# EAGLE design MotorControllerMainBoard (EAGLE 8.7.1)

## Sheet 1 of 6: Main Board Topology
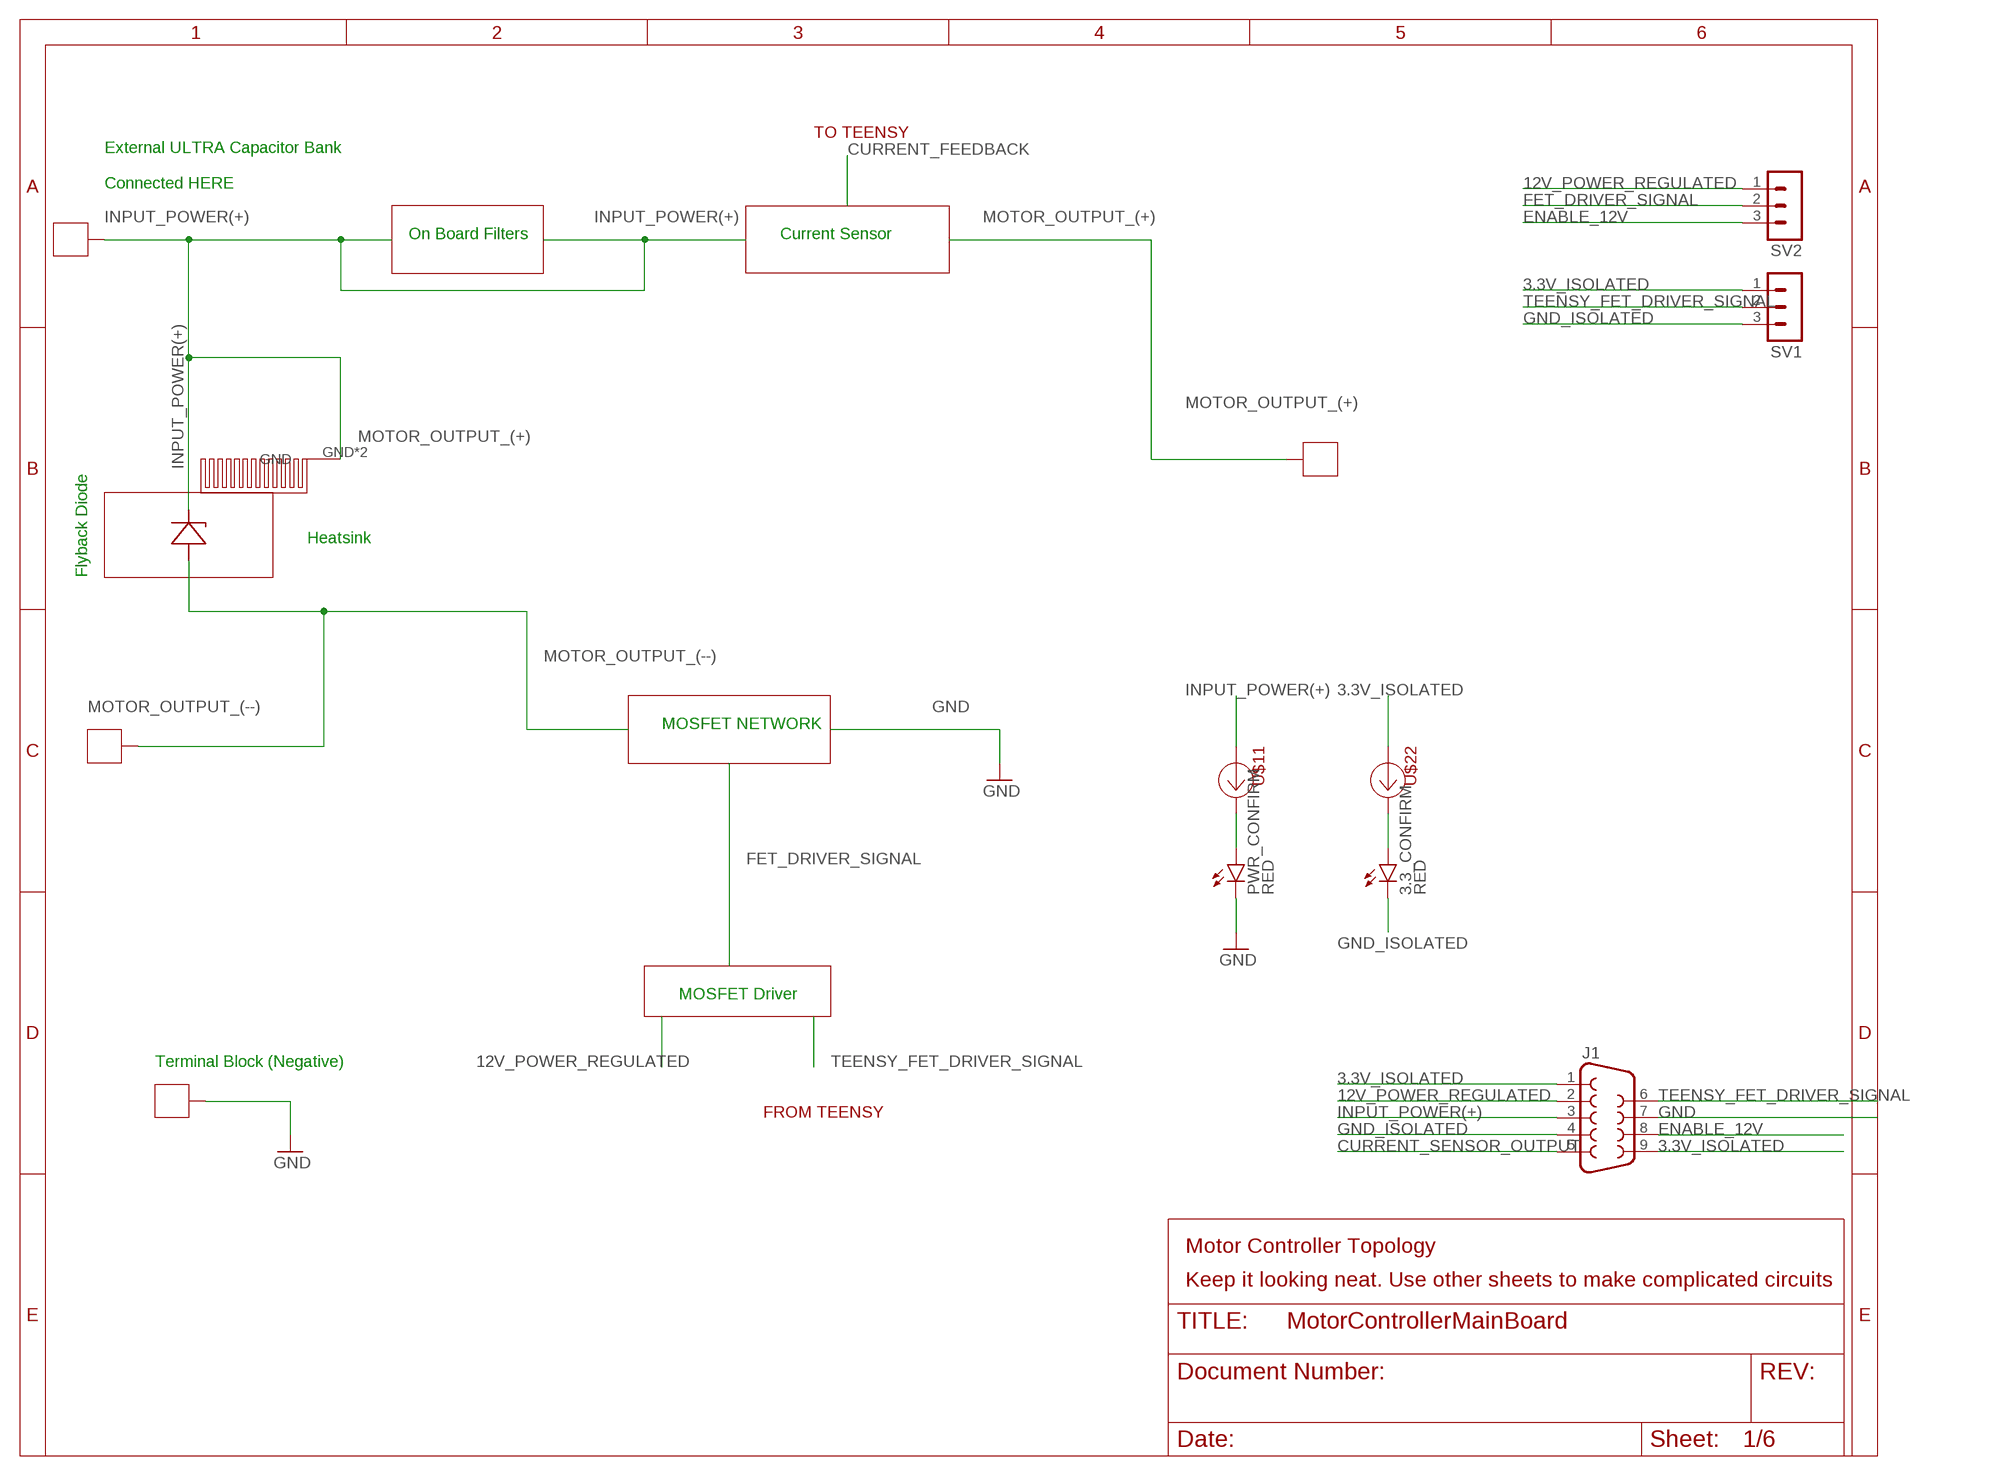
[diagram p0: schematic, sheet 1]

### Parts
3.3_CONFIRM  RED  LED-RED1206  [LED-1206]
J1  DB9FEMALE  [DB9]
PWR_CONFIRM  RED  LED-RED1206  [LED-1206]
SV1  MA03-1  [MA03-1]
SV2  MA03-1  [MA03-1]
U$5  FLYBACK  [TO]
U$11  AL5809-20S1-7  [SOD-123]
U$12  74650073R  [74650073R]
U$14  74650073R  [74650073R]
U$15  74650073R  [74650073R]
U$16  74650073R  [74650073R]
U$22  AL5809-20S1-7  [SOD-123]
U$23  DA-T263-101E  [DA-T263-101E]

### Nets
3.3V_ISOLATED: J1.1 J1.9 SV1.1 U$22.A ; also sheet 4
12V_POWER_REGULATED: J1.2 SV2.1 ; also sheet 3,5
CURRENT_SENSOR_OUTPUT: J1.5 ; also sheet 4
ENABLE_12V: J1.8 SV2.3 ; also sheet 5
FET_DRIVER_SIGNAL: SV2.2 ; also sheet 2,3
GND: J1.7 PWR_CONFIRM.C U$15.P$1 U$15.P$2 U$15.P$3 U$15.P$4 ; also sheet 2,3,5,6
GND_ISOLATED: 3.3_CONFIRM.C J1.4 SV1.3 ; also sheet 3,4
INPUT_POWER(+): J1.3 U$5.CATHODE U$11.A U$14.P$1 U$14.P$2 U$14.P$3 U$14.P$4 U$23.GND U$23.GND2\(GND) ; also sheet 4,5
MOTOR_OUTPUT_(+): U$16.P$1 U$16.P$2 U$16.P$3 U$16.P$4 ; also sheet 4,6
MOTOR_OUTPUT_(--): U$5.ANODE U$12.P$1 U$12.P$2 U$12.P$3 U$12.P$4 ; also sheet 2
N$14: 3.3_CONFIRM.A U$22.C
N$17: PWR_CONFIRM.A U$11.C
TEENSY_FET_DRIVER_SIGNAL: J1.6 SV1.2 ; also sheet 3

### Notes on the sheet
- TO TEENSY
- External ULTRA Capacitor Bank 
  
  Connected HERE
- On Board Filters | Current Sensor
- Heatsink
- Flyback Diode
- MOSFET NETWORK
- MOSFET Driver
- Terminal Block (Negative)
- FROM TEENSY
- Motor Controller Topology
- Keep it looking neat. Use other sheets to make complicated circuits

## Sheet 2 of 6: MOSFET NETWORK
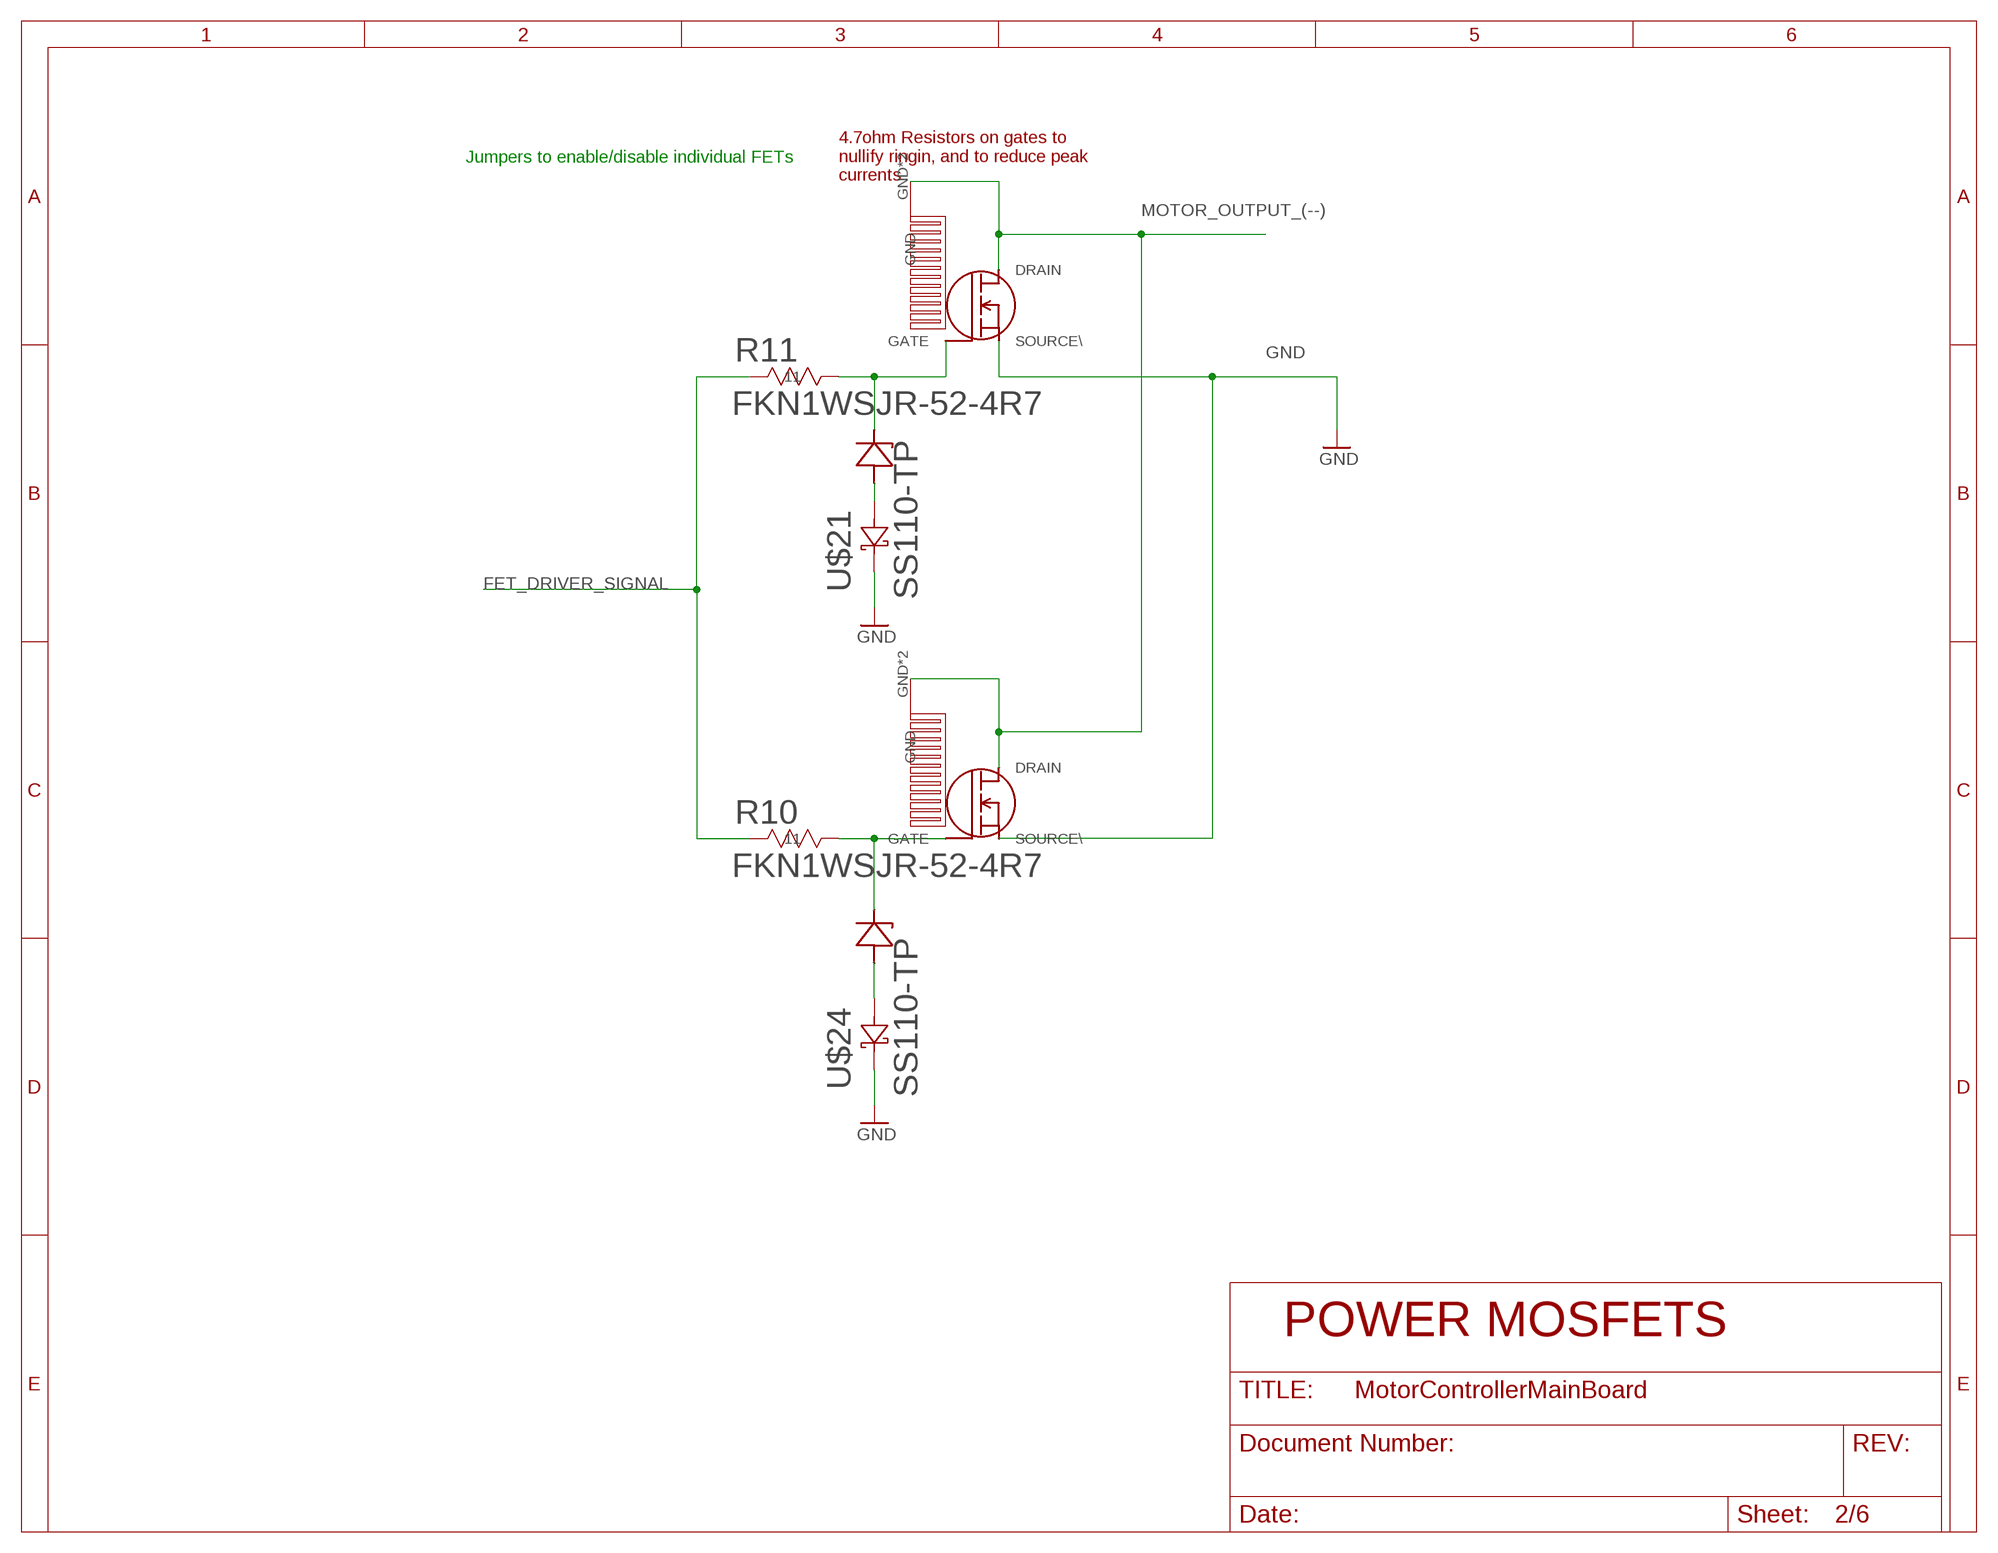
[diagram p1: schematic, sheet 2]

### Parts
R10  FKN1WSJR-52-4R7  [YAG_FKN50]
R11  FKN1WSJR-52-4R7  [YAG_FKN50]
U$1  IPB015N08N5ATMA1  [IPB015N08N5ATMA1]
U$2  IPB015N08N5ATMA1  [IPB015N08N5ATMA1]
U$3  DA-T263-101E  [DA-T263-101E]
U$4  DA-T263-101E  [DA-T263-101E]
U$7  SMBJ15CD  [SMB-DIODE]
U$20  SMBJ15CD  [SMB-DIODE]
U$21  SS110-TP  [SMA-DIODE]
U$24  SS110-TP  [SMA-DIODE]

### Nets
FET_DRIVER_SIGNAL: R10.1 R11.1 ; also sheet 1,3
GND: U$1.SOURCE(SOURCE\) U$2.SOURCE(SOURCE\) U$21.C(CATHODE) U$24.C(CATHODE) ; also sheet 1,3,5,6
MOTOR_OUTPUT_(--): U$1.DRAIN U$2.DRAIN U$3.GND U$3.GND2\(GND) U$4.GND U$4.GND2\(GND) ; also sheet 1
N$1: U$7.A(ANODE) U$24.A(ANODE)
N$2: R10.2 U$2.GATE U$7.C(CATHODE)
N$4: U$20.A(ANODE) U$21.A(ANODE)
N$10: R11.2 U$1.GATE U$20.C(CATHODE)

### Notes on the sheet
- Jumpers to enable/disable individual FETs
- 4.7ohm Resistors on gates to
  nullify ringin, and to reduce peak
  currents
- POWER MOSFETS

## Sheet 3 of 6: MOSFET Driver
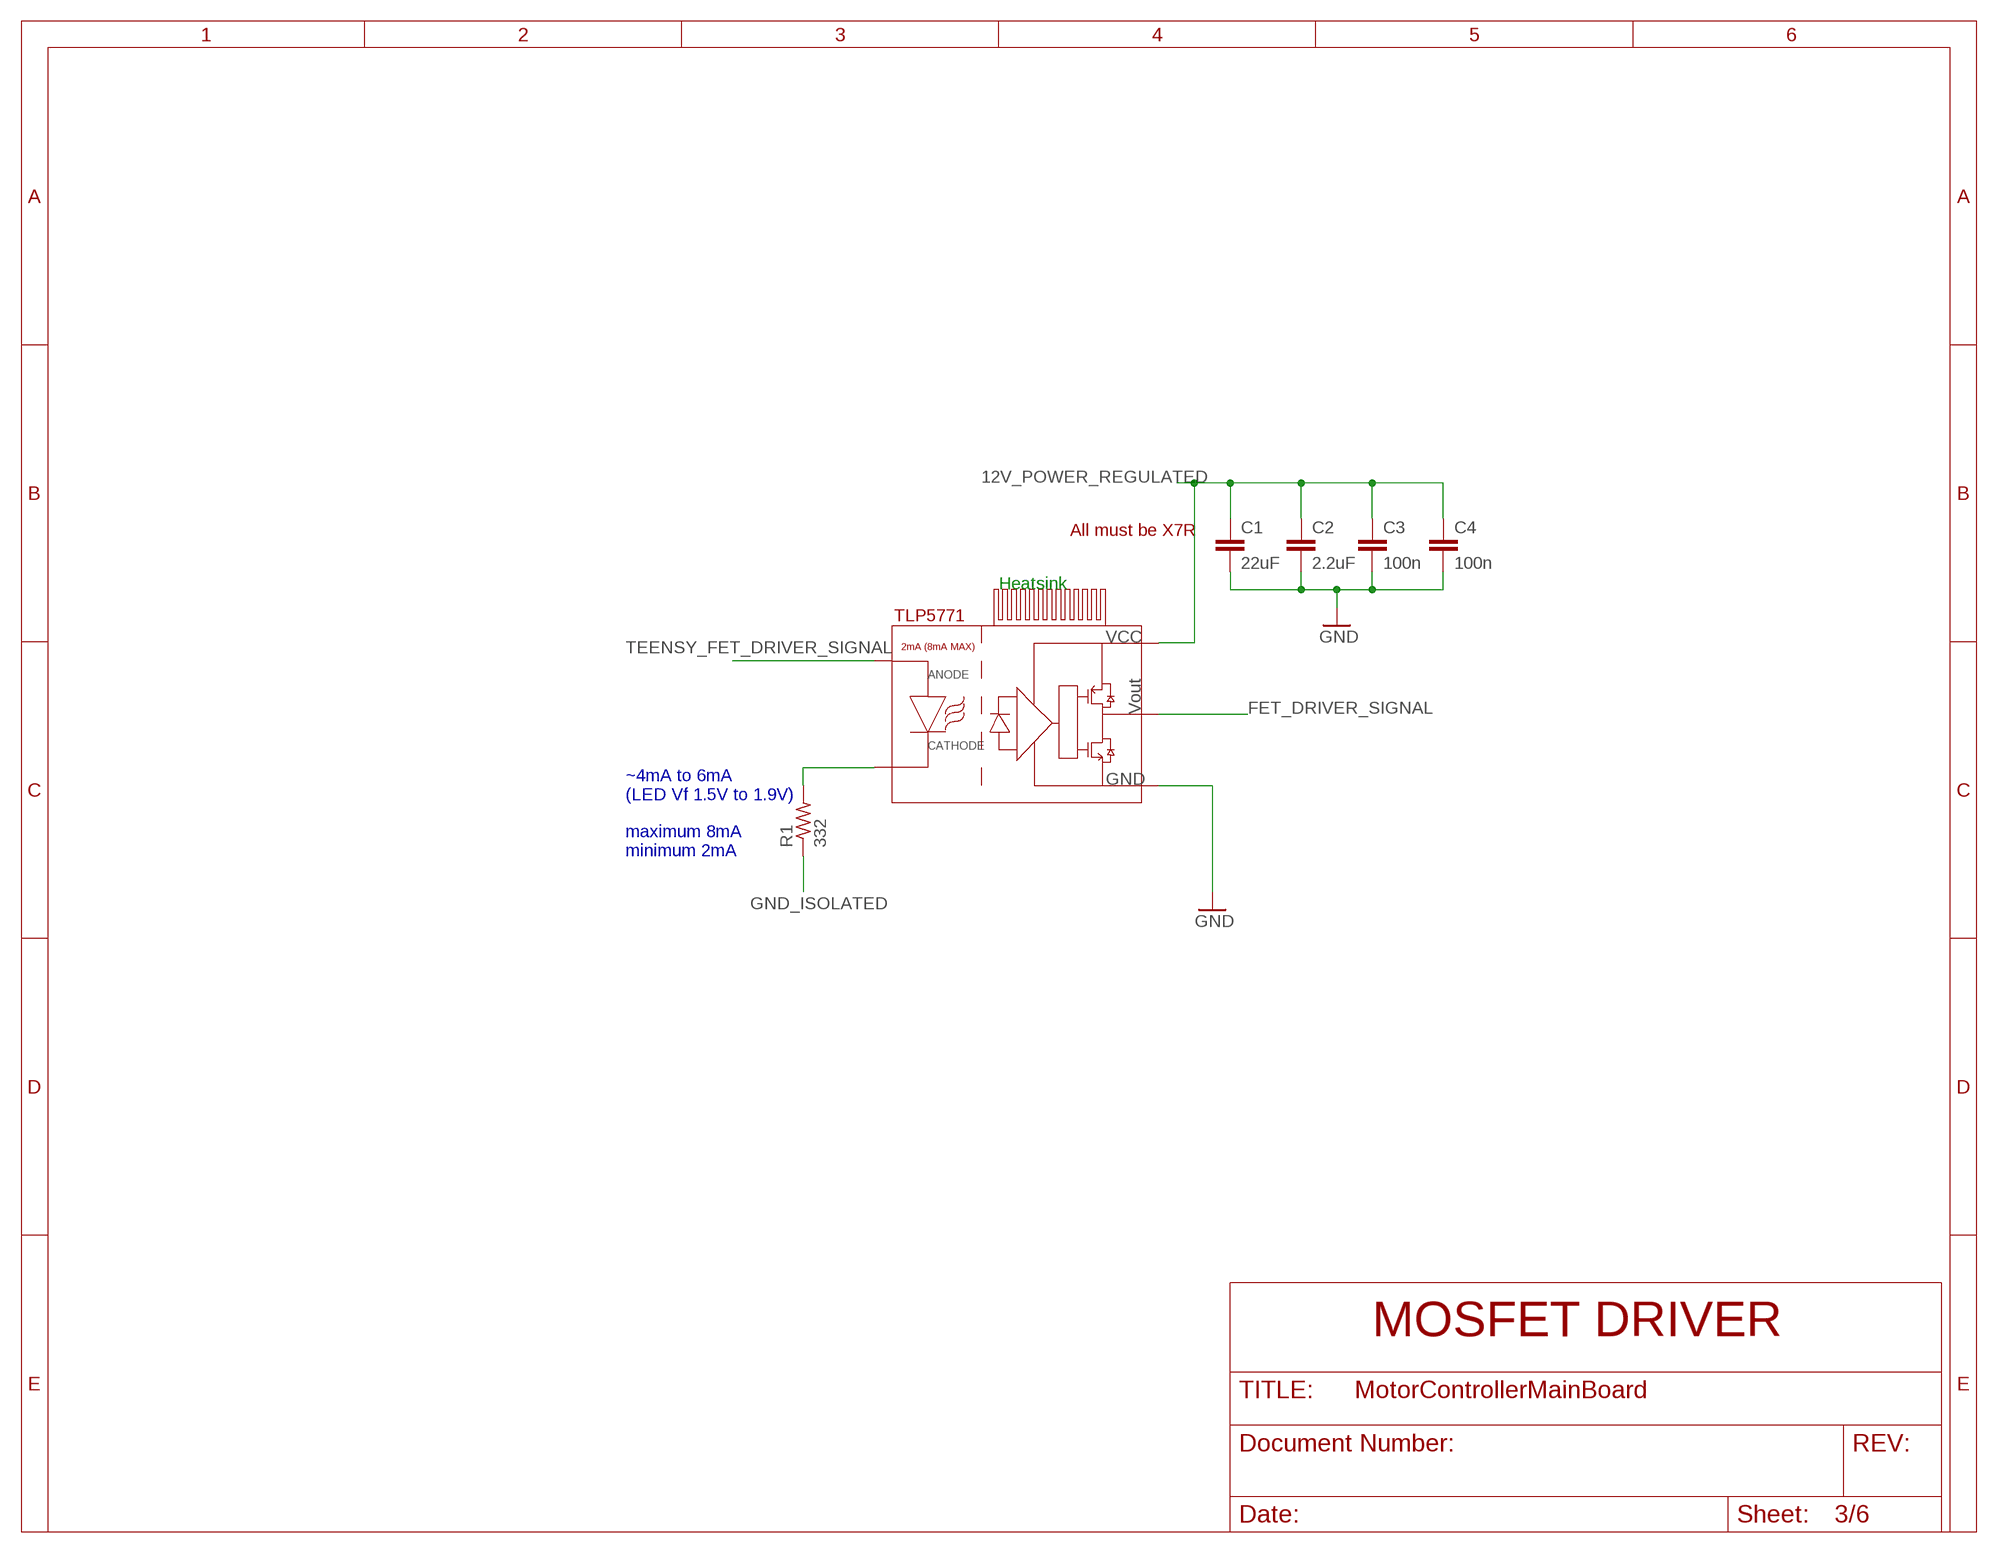
[diagram p2: schematic, sheet 3]

### Parts
C1  22uF  C-EUC1210  [C1210]
C2  2.2uF  C-EUC0805  [C0805]
C3  100n  C-EUC0603  [C0603]
C4  100n  C-EUC0603  [C0603]
R1  332  R-US_R0805  [R0805]
U$17  TLP5771  [SOIC-6(TLP5771)]
U$25  LTN20069  [LTN20069]

### Nets
12V_POWER_REGULATED: C1.1 C2.1 C3.1 C4.1 U$17.6.VCC ; also sheet 1,5
FET_DRIVER_SIGNAL: U$17.5.VOUT ; also sheet 1,2
GND: C1.2 C2.2 C3.2 C4.2 U$17.4.GND ; also sheet 1,2,5,6
GND_ISOLATED: R1.1 ; also sheet 1,4
N$7: R1.2 U$17.2.NC(3.CATHODE) U$17.3:CATHODE(3.CATHODE)
TEENSY_FET_DRIVER_SIGNAL: U$17.1.ANODE ; also sheet 1

### Notes on the sheet
- All must be X7R
- Heatsink
- ~4mA to 6mA 
  (LED Vf 1.5V to 1.9V)
  
  maximum 8mA
  minimum 2mA
- MOSFET DRIVER

## Sheet 4 of 6: Current Sensor
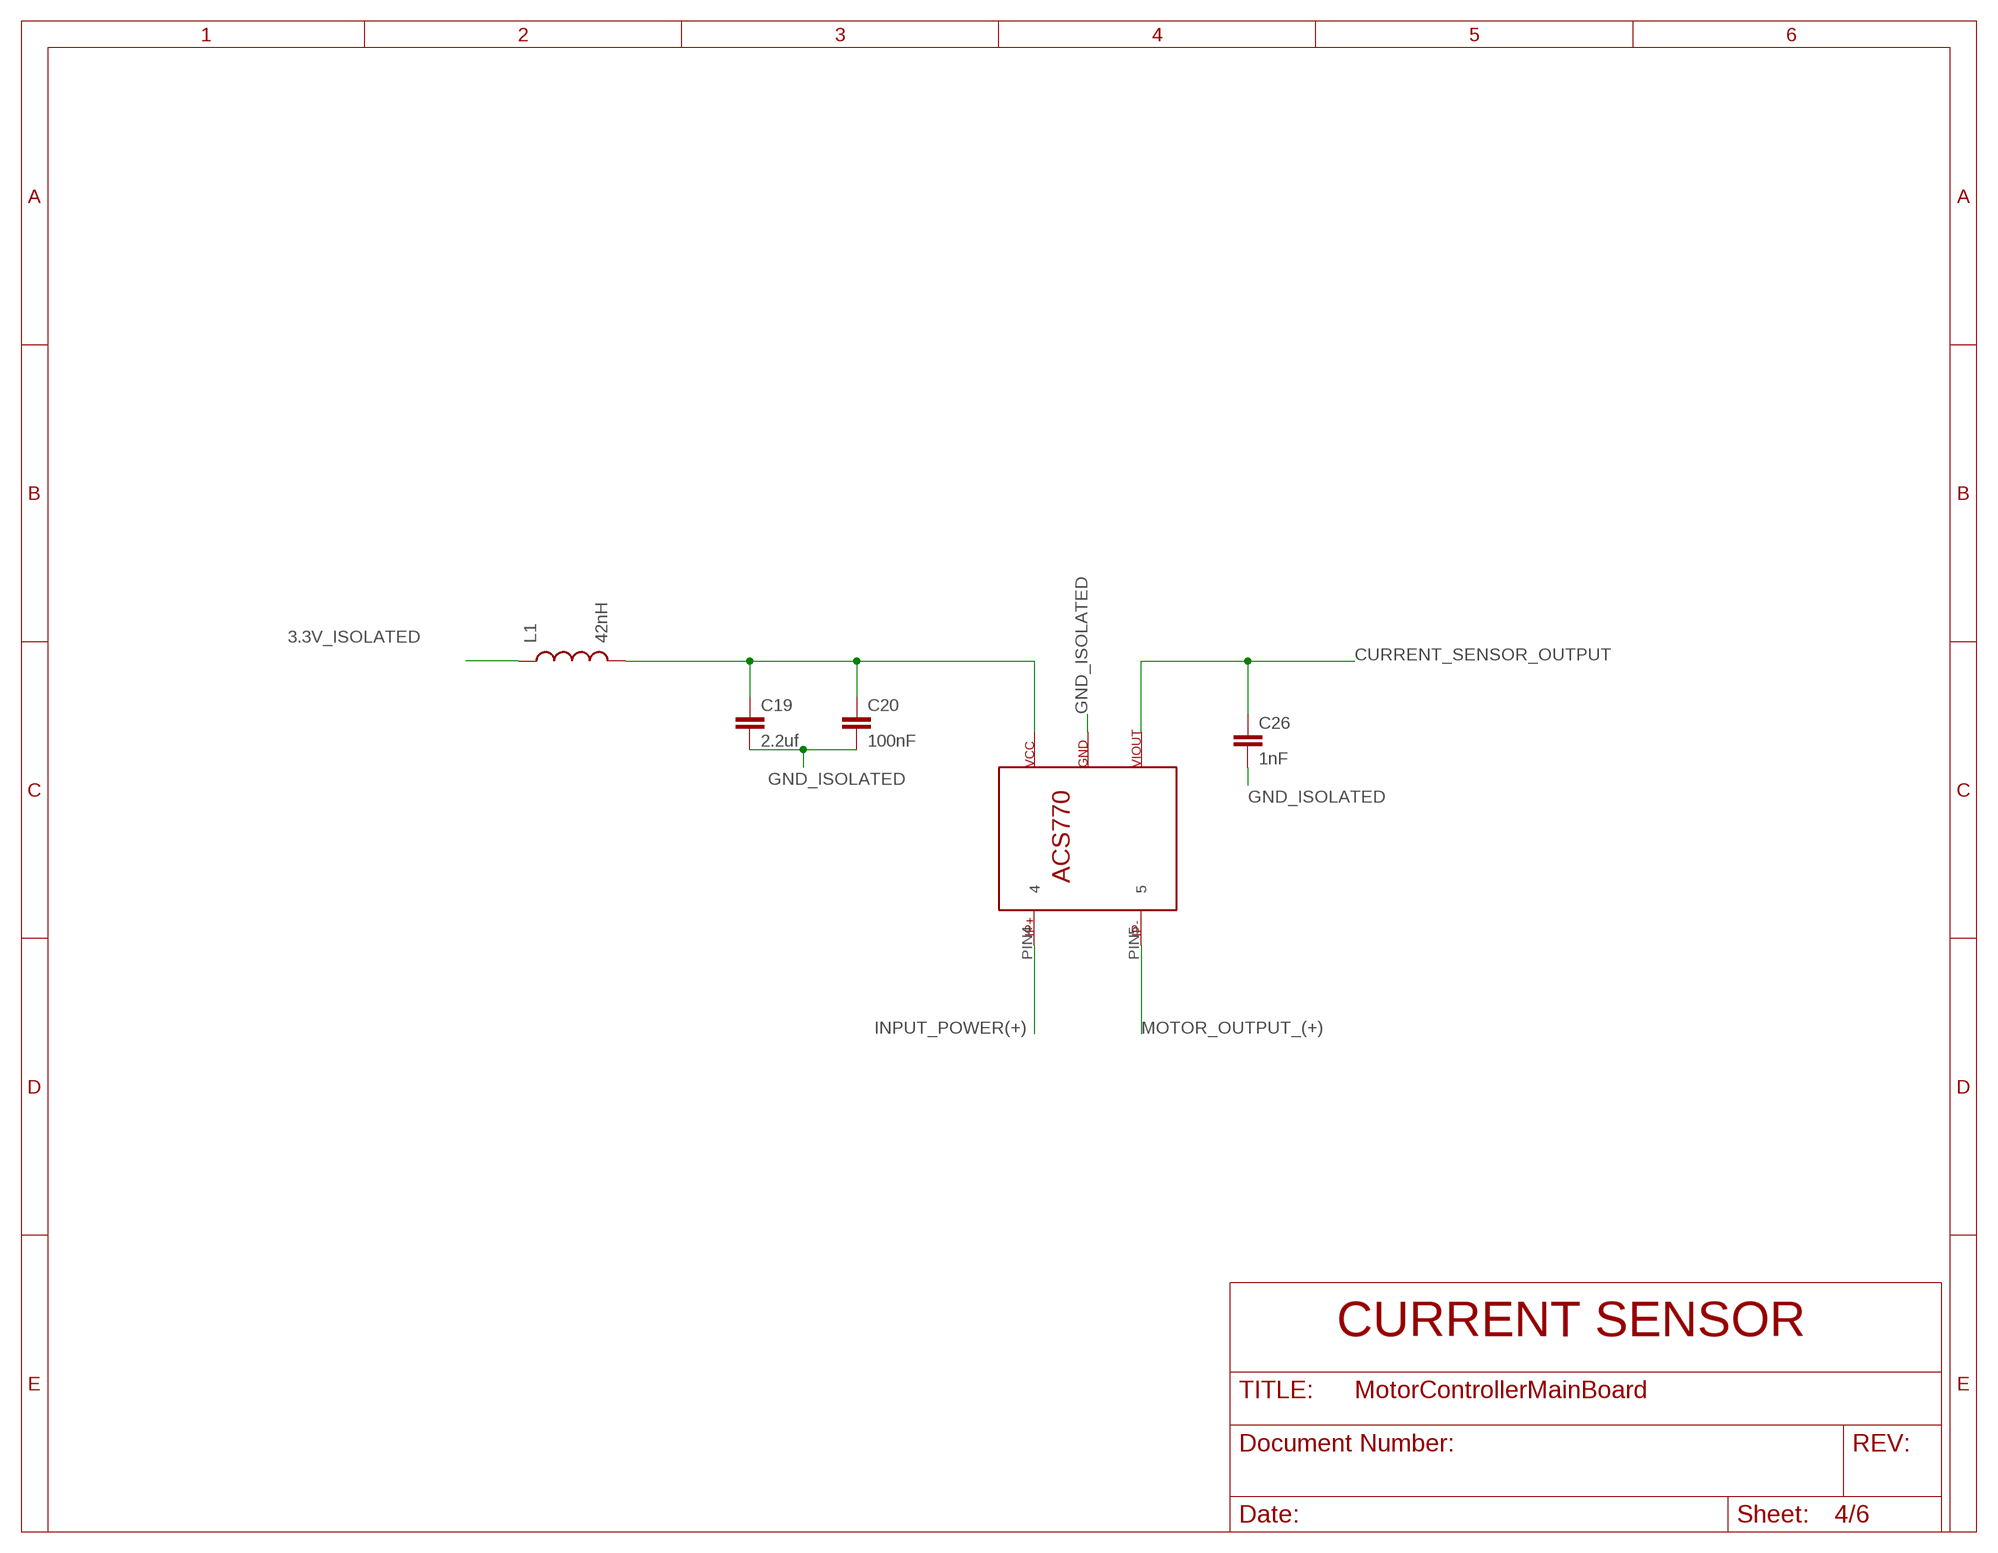
[diagram p3: schematic, sheet 4]

### Parts
C19  2.2uf  C-EUC0805  [C0805]
C20  100nF  C-EUC0805  [C0805]
C26  1nF  C-EUC0805  [C0805]
L1  42nH  INDUCTOR0805  [0805]
U$9  ACS770LCB_CURRENTSENSOR  [ACS770LCB_CURRENTSENSOR]

### Nets
3.3V_ISOLATED: L1.1 ; also sheet 1
CURRENT_SENSOR_OUTPUT: C26.1 U$9.PIN3 ; also sheet 1
GND_ISOLATED: C19.2 C20.2 C26.2 U$9.PIN2 ; also sheet 1,3
INPUT_POWER(+): U$9.PIN4 ; also sheet 1,5
MOTOR_OUTPUT_(+): U$9.PIN5 ; also sheet 1,6
N$6: C19.1 C20.1 L1.2 U$9.PIN1

### Notes on the sheet
- CURRENT SENSOR

## Sheet 5 of 6: Power Supply
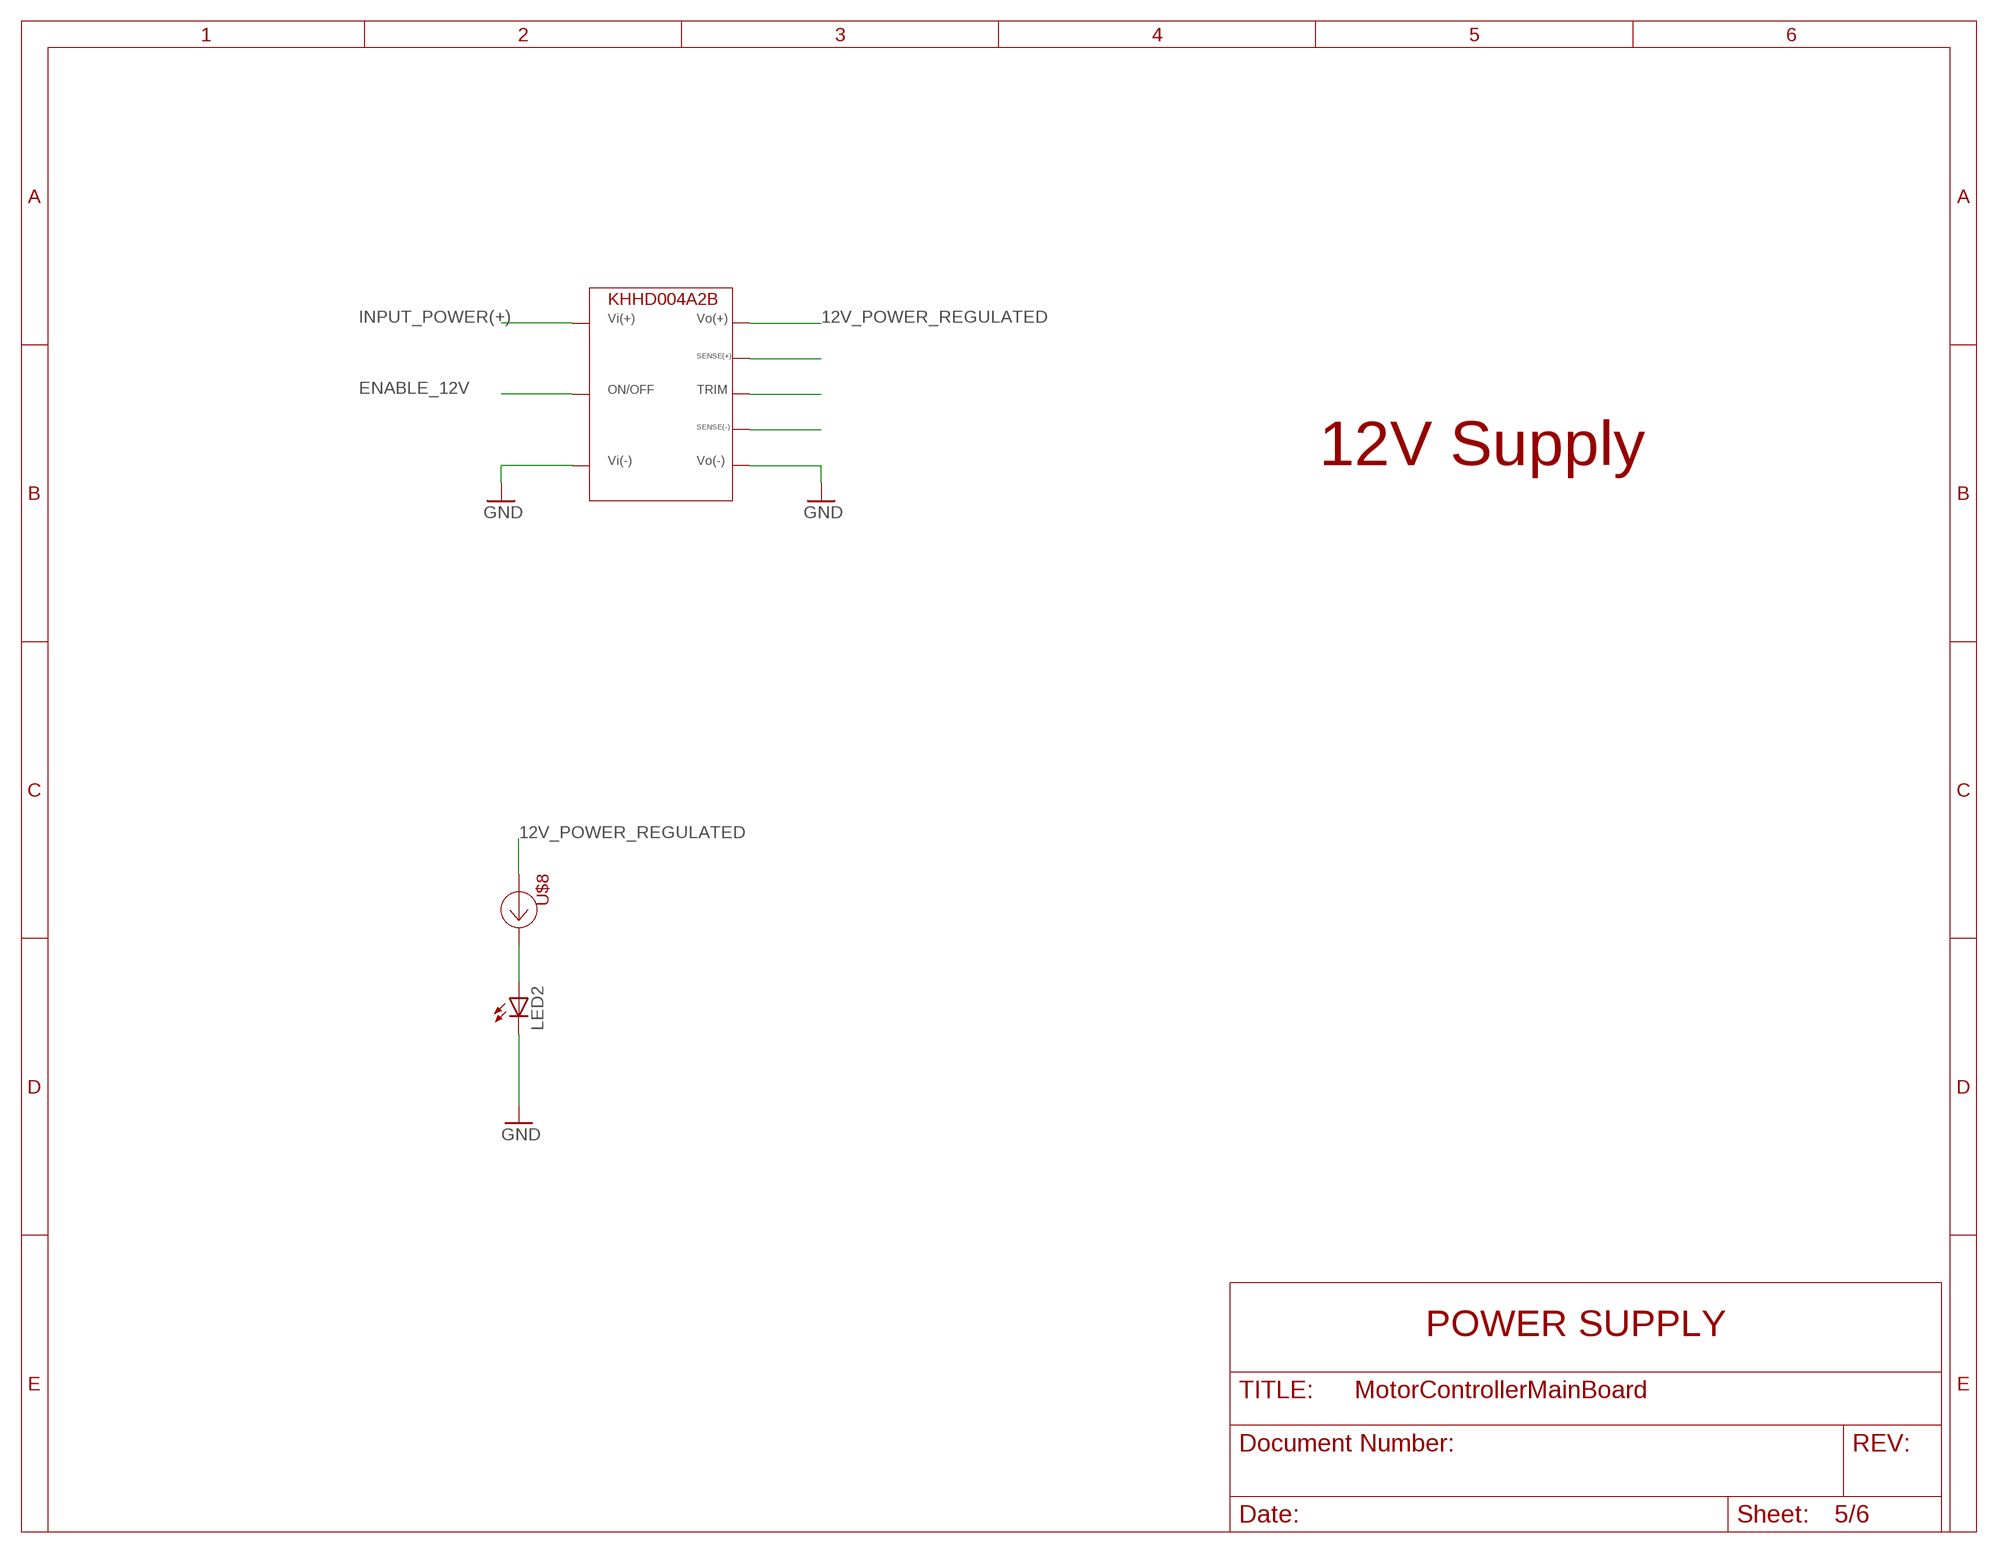
[diagram p4: schematic, sheet 5]

### Parts
LED2  LED1206  [LED-1206]
U$6  KHHD004A2B  [KHHD004A2B]
U$8  AL5809-20S1-7  [SOD-123]

### Nets
12V_POWER_REGULATED: U$6.VO+(VO(+)) U$8.A ; also sheet 1,3
ENABLE_12V: U$6.ON/OFF ; also sheet 1
GND: LED2.C U$6.VI-(VI(-)) U$6.VO-(VO(-)) ; also sheet 1,2,3,6
INPUT_POWER(+): U$6.VI+(VI(+)) ; also sheet 1,4
N$5: U$6.SENSE-(SENSE(-))
N$8: U$6.TRIM
N$9: LED2.A U$8.C
N$11: U$6.SENSE+(SENSE(+))

### Notes on the sheet
- 12V Supply
- POWER SUPPLY

## Sheet 6 of 6: Input Filters
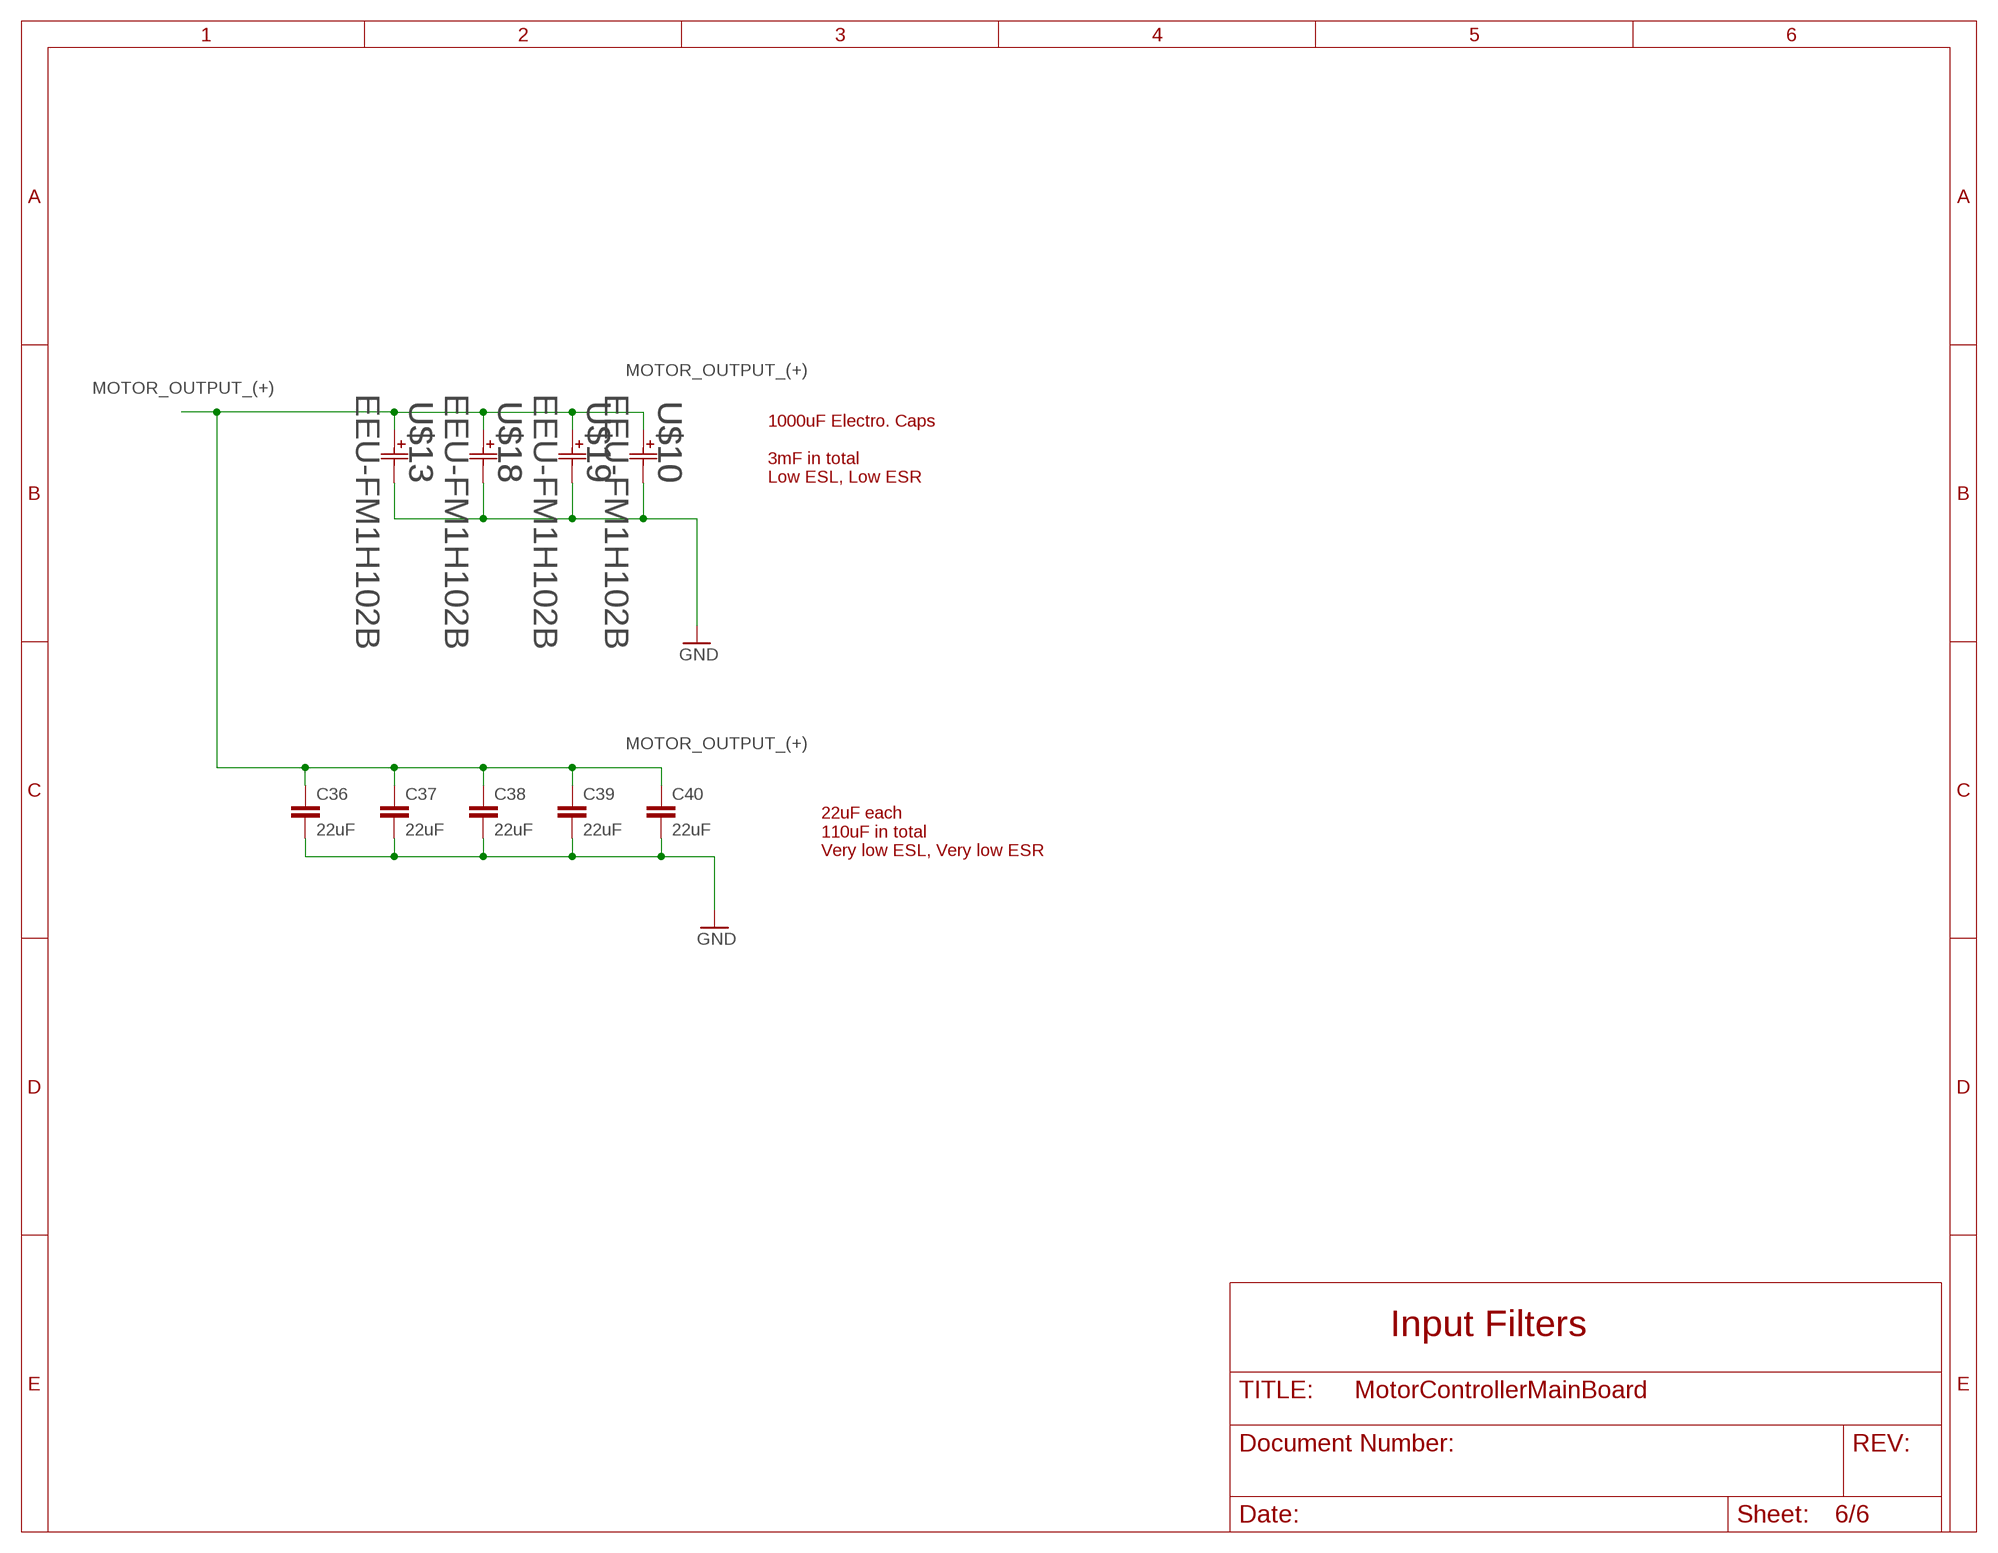
[diagram p5: schematic, sheet 6]

### Parts
C36  22uF  C-EUC1210  [C1210]
C37  22uF  C-EUC1210  [C1210]
C38  22uF  C-EUC1210  [C1210]
C39  22uF  C-EUC1210  [C1210]
C40  22uF  C-EUC1210  [C1210]
U$10  EEU-FM1H102B  [EEU-FM1H102B]
U$13  EEU-FM1H102B  [EEU-FM1H102B]
U$18  EEU-FM1H102B  [EEU-FM1H102B]
U$19  EEU-FM1H102B  [EEU-FM1H102B]

### Nets
GND: C36.2 C37.2 C38.2 C39.2 C40.2 U$10.NEGATIVE U$13.NEGATIVE U$18.NEGATIVE U$19.NEGATIVE ; also sheet 1,2,3,5
MOTOR_OUTPUT_(+): C36.1 C37.1 C38.1 C39.1 C40.1 U$10.POSITIVE U$13.POSITIVE U$18.POSITIVE U$19.POSITIVE ; also sheet 1,4

### Notes on the sheet
- 1000uF Electro. Caps
  
  3mF in total
  Low ESL, Low ESR
- 22uF each
  110uF in total
  Very low ESL, Very low ESR
- Input Filters

## Library data of the parts
3.3_CONFIRM PWR_CONFIRM = SparkFun-LED:LED-RED: Assorted Red LEDs LilyPad 1206- DIO-09912 1206- DIO-00809 0603- DIO-00819 "SMART" means more efficient and expensive; PROD_ID: DIO-09912
C1-C4 C36-C40 = rcl:C-EU: CAPACITOR, European symbol; SPICEPREFIX: C
C19 C20 C26 = resistor:C-EU: CAPACITOR, European symbol
J1 = SparkFun-Connectors:DB9: DB9 Connector Standard DB9 (D-Sub 9) serial connector. Can be used for CAN bus as well as RS485 and RS232. Footprint production proven. Spark Fun Electronics SKU : PRT-00429; PROD_ID: CONN-08194
L1 = SparkFun (2015_10_14 22_27_04 UTC):INDUCTOR: Inductors Basic Inductor/Choke - 0603 and 1206. Footprints are not proven and vary greatly between part numbers.
LED2 = SparkFun (2015_10_14 22_27_04 UTC):LED: LEDs Standard schematic elements and footprints for 5mm, 3mm, 1206, and 0603 sized LEDs. 5mm - Spark Fun Electronics SKU : COM-00529 (and others)
R1 = resistor:R-US_: RESISTOR, American symbol
R10 R11 = MotorControllerEagleLibrary:FKN1WSJR-52-4R7; MANUFACTURER_PART_NUMBER: FKN1WSJR524R7; VENDOR: Yageo
SV1 SV2 = con-lstb:MA03-1: PIN HEADER; OC_FARNELL: unknown; OC_NEWARK: unknown
U$1 U$2 = MotorControllerEagleLibrary:IPB015N08N5ATMA1
U$3 U$4 U$23 = MotorControllerEagleLibrary:DA-T263-101E
U$5 = MotorControllerEagleLibrary:FLYBACK
U$6 = MotorControllerEagleLibrary:KHHD004A2B
U$7 U$20 = MotorControllerEagleLibrary:SMBJ15CD
U$8 U$11 U$22 = MotorControllerEagleLibrary:AL5809-20S1-7
U$9 = ACS770 Current Sensor:ACS770LCB_CURRENTSENSOR
U$10 U$13 U$18 U$19 = MotorControllerEagleLibrary:EEU-FM1H102B
U$12 U$14-U$16 = MotorControllerEagleLibrary:74650073R
U$17 = MotorControllerEagleLibrary:TLP5771
U$21 U$24 = MotorControllerEagleLibrary:SS110-TP
U$25 = MotorControllerEagleLibrary:LTN20069

## Board
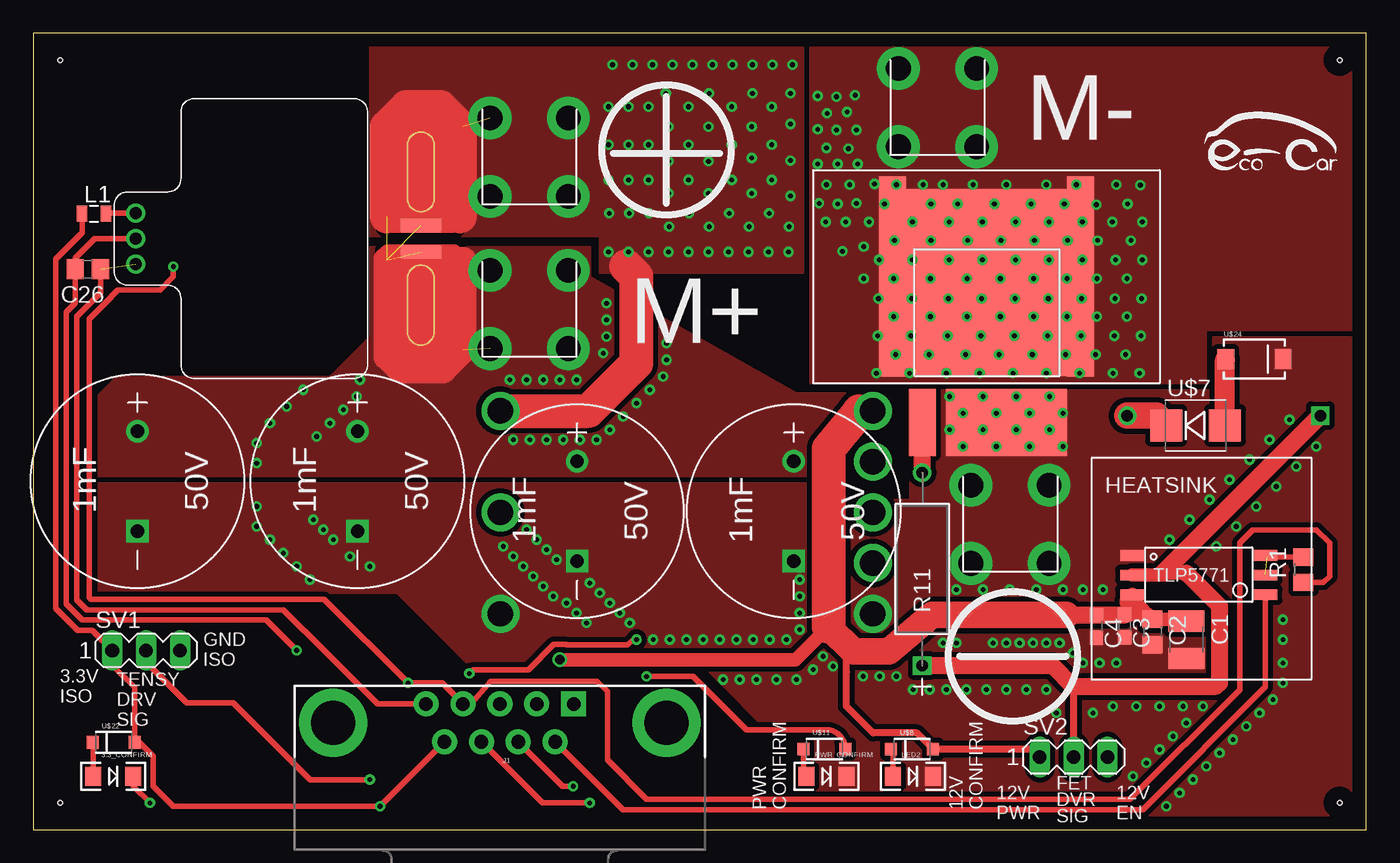
[diagram p6: board, top side]
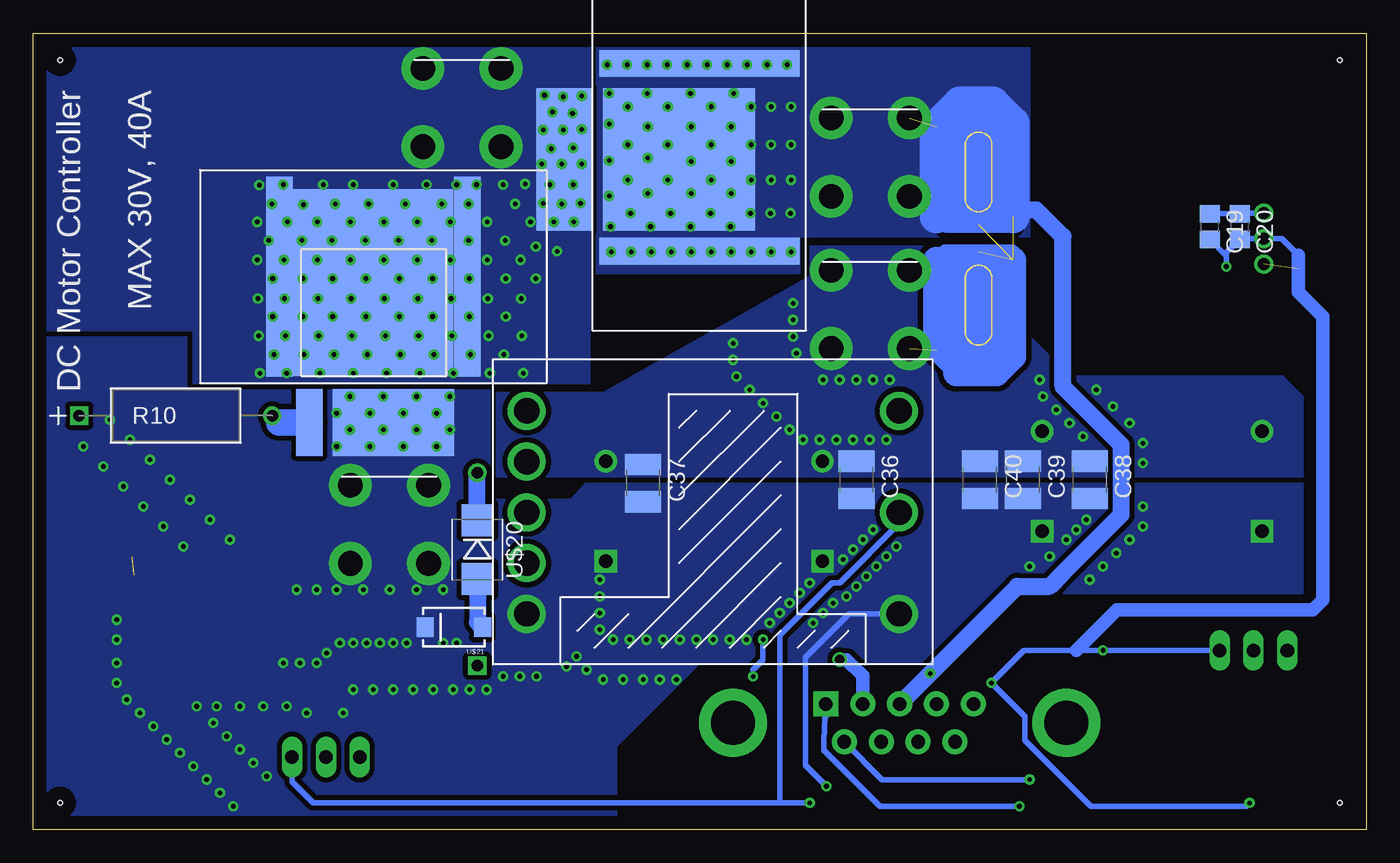
[diagram p7: board, bottom side, seen from below]

Size 100 x 59.75 mm. Coordinates in mm from the lower left corner, seen from the top.
Outline: 0,0 100,0 100,59.75 0,59.75 0,0
Copper layers (1*16): Top 0.035mm / dielectric 1.5mm / Bottom 0.035mm
Design rules "default *": minimum track width 15mil, minimum drill 0.35mm, track to track 15mil, track to pad 15mil, pad to pad 15mil, via to via 15mil, smd to smd 15mil, copper to edge 40mil, drill to drill 15mil, minimum pad ring 10mil, minimum via ring 8mil, stop-mask expansion 4mil, vias tented up to drill 0mil, thermal gap 10mil
Holes 0.35 mm at 2,2 2,57.75 98,57.75 98,2

### Footprints (pad centres in the part's own frame; a part is rotated, then mirrored left to right if it is on the bottom)
LED-1206 = smd 1.2 x 1.4: A -1.5,0; C 1.5,0
C1210 = smd 1.6 x 2.7: 1 -1.4,0; 2 1.4,0
C0805 = smd 1.3 x 1.5: 1 -0.95,0; 2 0.95,0
C0603 = smd 1.1 x 1: 1 -0.85,0; 2 0.85,0
DB9 = drill 1.016 pad 1.88 square: 1 -5.54,-1.42 | drill 1.016 pad 1.88: 2 -2.77,-1.42; 3 0,-1.42; 4 2.77,-1.42; 5 5.54,-1.42; 6 -4.15,1.42; 7 -1.38,1.42; 8 1.38,1.42; 9 4.15,1.42 | drill 3.302 pad 5.08: G1 -12.5,0; G2 12.5,0
0805 = smd 0.8 x 1.2: 1 -0.9,0; 2 0.9,0
R0805 = smd 1.3 x 1.5: 1 -0.95,0; 2 0.95,0
YAG_FKN50 = drill 0.864 pad 1.372 square: 1 -14.478,0 | drill 0.864 pad 1.372: 2 0,0
MA03-1 = drill 1.016 long: 1 -2.54,0; 2 0,0; 3 2.54,0
IPB015N08N5ATMA1 = smd 12 x 14: DRAIN 0,1.3 | smd 2 x 5: GATE -4.8,-9.2 | smd 9.1 x 5: SOURCE 1.5,-9.2
DA-T263-101E = smd 2 x 15: GND -7.05,0; GND2\ 7.05,0
TO = smd 10.7 x 4.13: ANODE 0,-8.6 | smd 10.7 x 11.4: CATHODE 0,0
KHHD004A2B = drill 1.9: ON/OFF 0,7.62; SENSE+ 27.94,3.81; SENSE- 27.94,11.43; TRIM 27.94,7.62; VI+ 0,0; VI- 0,15.24; VO+ 27.94,0; VO- 27.94,15.24
SMB-DIODE = smd 2.4 x 2.4: A 2.2,0; C -2.2,0
SOD-123 = smd 0.9 x 0.95: A 1.575,0; C -1.575,0
ACS770LCB_CURRENTSENSOR = drill 0.9: PIN1 -1.91,-21.4; PIN2 0,-21.4; PIN3 1.91,-21.4 | smd 1 x 3: PIN4 1,0; PIN5 -1,0
EEU-FM1H102B = drill 1 pad 1.676 square: NEGATIVE -3.75,0 | drill 1 pad 1.676: POSITIVE 3.75,0
74650073R = drill 1.85 pad 3.2: P$1 0,0; P$2 5.87,0; P$3 0,5.87; P$4 5.87,5.87
SOIC-6(TLP5771) = smd 0.8 x 1.8: 1.ANODE -3.34,-9.1; 2.NC -1.87,-9.1; 3:CATHODE -0.4,-9.1; 4.GND -0.4,0.9; 5.VOUT -1.87,0.9; 6.VCC -3.34,0.9
SMA-DIODE = smd 1.27 x 1.47: A -2.15,0; C 2.15,0

### Placement (x,y rotation side)
3.3_CONFIRM  6,4 0 top
C1  86.5,14.25 270 top
C2  83.96,14.83 270 top
C3  81.87,15.28 270 top
C4  79.75,15.25 270 top
C19  11.75,45.25 270 bottom
C20  9.5,45.25 270 bottom
C26  4.09,42.04 180 top
C36  38.25,26.25 270 bottom
C37  54.25,26 270 bottom
C38  20.75,26.25 270 bottom
C39  25.75,26.25 270 bottom
C40  29,26.25 270 bottom
J1  35,8 180 top
L1  4.56,46.21 0 top
LED2  66,4 0 top
PWR_CONFIRM  59.5,4 0 top
R1  95.29,19.49 90 top
R10  82.08,31.06 0 bottom
R11  66.69,26.78 90 top
SV1  8.46,13.44 0 top
SV2  78.05,5.44 0 top
U$1  71.5,39.75 0 top
U$2  74.5,39.75 0 bottom
U$3  71.5,41.5 0 top
U$4  74.5,41.5 0 bottom
U$5  51.56,50.3 270 bottom
U$6  35.04,31.42 180 bottom
U$7  87.2,30.32 0 top
U$8  65.93,6.04 0 top
U$9  29.07,44.35 270 top
U$10  24.32,26.14 90 top
U$11  59.35,6.04 0 top
U$12  64.91,51.24 0 top
U$13  7.82,26.14 90 top
U$14  34.27,47.52 0 top
U$15  70.35,19.97 0 top
U$16  34.27,36.09 0 top
U$17  83.34,20.97 90 top
U$18  57.05,23.89 90 top
U$19  40.8,23.89 90 top
U$20  66.68,21 270 bottom
U$21  68.46,15.19 180 bottom
U$22  6.02,6.54 0 top
U$23  50.03,50.45 90 bottom
U$24  91.61,35.31 0 top
U$25  79.39,11.28 0 top
U$26  [LOGO]  93.25,51.25 0 top

### Tracks (layer width: path | path; a pad name or v marks a point on that pad's centre or on a via)
3.3V_ISOLATED  (via drill 0.35)
  Top 0.406: J1.9 v26.02,1.75 10.5,1.75 9,3.25 9,5.5 7.96,6.54 U$22.A 7.59,10.65 5.92,12.33 SV1.1 4.43,14.93 3.35,14.93 1.68,16.6 1.68,42.8 3.66,44.79 L1.1
  Bottom 0.406: J1.1 40.54,8.46 40.6,8.5 40.67,6.67 40.67,5.95 36.48,1.75 v26.02,1.75
12V_POWER_REGULATED  (via drill 0.7)
  Top 0.406: 61.01,12.85 61.52,13.37
  Top 0.508: SV2.1 74.91,6.04 U$8.A 66.3,7.25 63,7.25 61.01,9.24 61.01,11.82 61.01,11.83 61.01,12.67 61.01,12.68 61.01,12.85
  Top 1.016: U$6.VO+ 61.98,31.38 | 81.84,16.1 C3.1 83.61,16.13 C2.1 | C2.1 86.37,15.78 C1.1 | C2.1 82.74,17 82,17 82,17.19 U$17.6.VCC | 59.67,15.22 57.19,12.75 v39.5,12.75
  Top 1.27: 81.84,16.1 C4.1 77.5,16.1
  Top 2: 59.67,15.22 61.52,13.37 64.19,13.37 67.42,16.1 77.5,16.1
  Top 2.54: 61.98,31.38 59.67,28.57 59.67,15.22
  Bottom 1.016: J1.2 37.77,11.52 39,12.75 v39.5,12.75
CURRENT_SENSOR_OUTPUT  (1 unrouted)
  Top 0.406: J1.5 25.83,9.42 21.88,13.38 18.75,16.5 4,16.5 3.25,17.25 3.25,38.5 5.04,40.29 C26.1
ENABLE_12V  (via drill 0.35)
  Top 0.406: J1.8 38.2,2 v41.75,2
  Bottom 0.406: v41.75,2 44,2 | 44,2 79,2 80.59,3.59 SV2.3 | 44,2 44,14.59 40.09,18.5 39.5,18.5 35.04,22.96 U$6.ON/OFF
FET_DRIVER_SIGNAL
  Top 0.508: SV2.2 78.05,10.7 78,10.75
  Top 1.016: U$17.5.VOUT 84.6,19.1 84.75,19.25 86.5,19.25 | 88.75,10.75 89,11
  Top 1.27: R11.1 76.45,12.3 78,10.75 88.75,10.75 | 89,11 89,16.75 86.5,19.25
  Top 1.3: 84.75,19.25 R10.1
GND  (via drill 0.35)
  Top 0.406: J1.7 39.71,3.25 v40.5,3.25
  Bottom 0.406: U$6.VI- 38.82,16.18 42.06,12.94 42.06,4.81 v40.5,3.25
  other vias: 44.75,15.5 44,16.25 43.25,17 42.5,17.75 41.75,18.5 36,20.5 35.25,21.25 39.25,20.25 38.5,21 37.75,21.75 37,22.5 69.25,18 71.25,18 73.25,18 75.25,18 77.25,18 78.75,18 80.25,18 85.25,21.75 86.75,23.25 88.25,24.75 89.75,26.25 91.25,27.75 92.75,29.25 94.25,30.75 88.75,21.25 90.25,22.75 91.75,24.25 93.25,25.75 94.75,27.25 96.25,28.75 68.25,14 69.25,14 73,14 72,14 74,14 75,14 76,14 77,14 78,13.25 78.75,12.5 80,12.5 81.25,12.5 57.5,18.75 57.5,17.5 57.5,16.25 57.5,15 62.25,11.5 63.5,11.5 64.75,11.5 66,10.5 67.25,10.5 68.5,10.5 71.5,10.5 70,10.5 73,10.5 74.5,10.5 76,10.5 76.75,8.75 79.5,8.75 81,9.25 82.75,9.25 84.5,9.25 86.25,9.25 87.75,9.25 86.5,8 85.5,7 84.5,6 83.5,5 82.5,4 85,1.75 86,2.75 87,3.75 88,4.75 89,5.75 90,6.75 91,7.75 92,8.75 93,9.75 93.75,11 93.75,12.5 93.75,14.25 93.75,15.75 68.75,32.5 71.25,32.5 73.75,32.5 76.25,32.5 77.25,31.25 74.75,31.25 72.25,31.25 69.75,31.25 68.75,30 71.25,30 73.75,30 76.25,30 77.25,28.75 74.75,28.75 72.25,28.75 69.75,28.75 46.5,14.25 47.75,14.25 49,14.25 50.25,14.25 51.5,14.25 52.75,14.25 54,14.25 55.25,14.25 56.5,14.25 51.75,11.25 53,11.25 54.25,11.25 55.75,11.25 57.25,11.25 58.5,12 59.25,13 60,12.25 36.75,19.75 37.5,19 38.25,18.25 39,17.5 40,17 40.75,16.25 41.5,15.5 20.75,18.75 19.75,19.75 18.75,20.75 17.75,21.75 16.75,22.75 16.75,24.25 21,23.25 21.75,22.5 22.5,21.75 23.75,20.5 25.25,19.75
  pour Top (rank 2, no thermals): 4.75,26 4.75,17.75 27.25,17.75 32.5,12.5 50,12.5 56.25,6.25 56.25,-1 101,-1 101.75,-0.25 101.75,37 88.5,37 88.5,33 65.75,33 65.75,24.75 59.75,24.75 58.5,26
  pour Bottom (rank 2, no thermals): 4.75,26 58.5,26 59.75,24.75 65.75,24.75 65.75,33 88.5,33 88.5,37 101.75,37 101.75,-0.25 101,-1 56.25,-1 56.25,6.25 50,12.5 32.5,12.5 27.25,17.75 4.75,17.75
GND_ISOLATED  (via drill 0.35)
  Top 0.406: v10.5,42.25 10.5,41.5 9.5,40.5 6.33,40.5 5.83,40 5.83,39.96 4.18,38.32 4.18,17.43 4.33,17.29 21.83,17.29 v28.11,11 30.65,11 J1.4 32.84,9.42 34.3,11.12 42.29,11.12 43.06,10.35 43.06,5.22 46,2.29 82.29,2.29 90.5,10.5 90.5,21.5 91.5,22.5 96.25,22.5 97.25,21.5 97.25,19 96.79,18.54 R1.1 | v8.75,2 7.5,3.25 3.3_CONFIRM.C | v19.75,13.44 17.48,15.71 3.67,15.71 2.46,16.92 2.46,38.83 3.14,39.5 C26.2 3.14,42.89 4.6,44.35 U$9.PIN2
  Bottom 0.406: C19.2 10.5,43.05 v10.5,42.25 10.5,43.3 C20.2 9.45,44.35 U$9.PIN2 6.35,44.35 5.1,43.1 | v8.75,2 9,1.75 20.67,1.75 25.62,6.71 25.62,8.51 v28.11,11 25.67,13.44 21.75,13.44 v19.75,13.44 SV1.3
  Bottom 1.016: 21.75,13.44 18.69,16.5 4,16.5 3.25,17.25 3.25,38.5 5.1,40.35 5.1,43.1
INPUT_POWER(+)  (via drill 0.35)  (4 unrouted)
  Top 0.406: U$11.A arc90 59.47,7.5 53.5,7.5 49.5,11.5 46,11.5 v46,11.48 | v32.71,11.71 33,12 37.14,12 39.03,13.89 39.97,13.89 40.02,13.84 44.59,13.84 45,14.25 v45.25,14.25
  Top 2.5: 26.5,46 26.5,52.75 28,54.25 30.5,54.25 32,52.75 32,46
  Top 2.54: U$6.VI+ 41.67,31.42 45.25,35 45.25,41.5 44.5,42.25
  Bottom 0.406: v46,11.48 46,12 45.25,12.75 v45.25,14.25
  Bottom 1.27: J1.3 v32.71,11.71 26.17,18.25 23.75,18.25 22.75,19.26 18.38,23.63 18.38,28.87 22.75,33.24 22.75,44.5 24.75,46.5 26,46.5 26.5,46
  Bottom 2: 26.5,42.75 26.5,35.5 27.75,34.25 30.75,34.25 30.75,34.75 32.25,36.25 32.25,42.75
  Bottom 2.5: 26.5,46 26.5,53 28,54.5 30.5,54.5 32.25,52.75 32.25,46
  other vias: 46.15,43.35 44.65,43.35 47.65,43.35 49.15,43.35 50.65,43.35 52.15,43.35 53.65,43.35 55.15,43.35 56.65,43.35 43.2,46.25 44.7,46.25 46.2,46.25 47.45,55.25 49.2,46.25 50.7,55.25 52.2,46.25 53.95,55.25 55.2,46.25 56.8,55.25 43.15,48.75 44.65,48.75 46.15,48.75 47.65,47.75 49.15,48.75 50.65,47.75 52.4,48.75 53.9,47.75 55.4,48.75 56.8,47.55 43.15,51.4 44.65,51.4 46.15,51.4 47.65,50.15 49.15,51.4 50.65,50.15 52.4,51.4 53.9,50.4 55.4,51.4 56.8,52.95 56.8,50.2 43.15,54.25 44.65,54.25 46.15,54.25 47.65,52.75 49.15,54.25 50.65,52.75 52.4,54.25 53.9,52.75 55.4,54.25 44.95,57.4 43.45,57.4 46.45,57.4 47.95,57.4 49.45,57.4 50.95,57.4 52.45,57.4 53.95,57.4 55.45,57.4 56.95,57.4 43.15,43.35 47.7,45.25 50.7,45.25 53.7,45.25 56.7,45.25
  pour Top (no thermals): 25.25,44.75 25.25,60.75 57.75,60.75 57.75,41.75 42.75,41.75 42.5,41.75 42.5,44.5 25.25,44.5
  pour Bottom (no thermals): 25.25,44.5 25.25,60.75 57.75,60.75 57.75,41.75 42.5,41.75 42.5,44.5
MOTOR_OUTPUT_(+)  (via drill 0.35)  (2 unrouted)
  Top 2: 26.5,42.75 26.5,35.5 27.5,34.5 30.75,34.5 32.25,36 32.25,42.75
  other vias: 36,29.25 37.25,29.25 38.5,29.25 39.75,29.25 41,29.25 42.25,29.25 43.25,30 44.25,31 45.25,32 46.25,33 47.25,34 47.5,35.25 47.5,36.5 43,39.5 43,38.25 43,37 42.75,35.75 40.75,33.75 39.5,33.75 38.25,33.75 37,33.75 35.75,33.75 16.75,27.5 16.75,29 17.75,30.5 19,31.75 20.25,33 24.5,33.75 24.25,32.5 23.25,31.5 22.25,30.5 21.25,29.5
  pour Top (no thermals): 4.75,26.5 4.75,32.5 6.25,34 22.25,34 25.25,37 25.25,43.75 41.75,43.75 41.75,41.5 57.25,32.75 65.25,32.75 65.25,26.5
  pour Bottom (no thermals): 4.75,26.5 4.75,32.5 6.25,34 22.25,34 25.25,37 25.25,43.75 41.75,43.75 41.75,41.5 57.25,32.75 65.25,32.75 65.25,26.5
MOTOR_OUTPUT_(--)  (via drill 0.35)
  other vias: 65.75,34.25 68.5,34.25 71,34.25 73.5,34.25 76,34.25 78.5,34.25 81,34.25 83,34.25 63.25,34.25 60.25,55 60.25,52.5 67.3,38.5 70.05,38.5 72.55,38.5 75.05,38.5 77.55,38.5 79.8,38.5 82.05,38.5 64.55,38.5 62.3,43.75 59.55,53.75 65.85,37.05 68.6,37.05 71.1,37.05 73.6,37.05 76.1,37.05 78.6,37.05 81.1,37.05 83.1,37.05 63.35,37.05 58.85,55.05 58.85,52.55 67.2,35.65 69.95,35.65 72.45,35.65 74.95,35.65 77.45,35.65 79.7,35.65 81.95,35.65 64.7,35.65 60.7,43.4 61.75,52.5 65.9,39.85 68.65,39.85 71.15,39.85 73.65,39.85 76.15,39.85 78.65,39.85 81.15,39.85 83.15,39.85 63.4,39.85 61.65,55.1 61.15,51.1 67.3,41.35 70.05,41.35 72.55,41.35 75.05,41.35 77.55,41.35 79.8,41.35 82.05,41.35 64.55,41.35 62.3,41.35 61.05,53.85 65.95,42.75 68.7,42.75 71.2,42.75 73.7,42.75 76.2,42.75 78.7,42.75 81.2,42.75 83.2,42.75 63.45,42.75 58.95,47 67.35,44.2 70.1,44.2 72.6,44.2 75.1,44.2 77.6,44.2 82.35,44.2 79.85,44.2 64.6,44.2 63.1,48.45 58.85,49.95 65.95,45.6 68.7,45.6 71.2,45.6 73.7,45.6 76.2,45.6 78.7,45.6 80.95,45.6 83.2,45.6 62.7,45.6 61.75,47 60.95,45.6 59.45,45.6 67.35,46.95 69.35,46.95 72.1,46.95 74.85,46.95 77.35,46.95 83.05,48.35 82.1,46.95 63.85,46.95 61.85,49.95 60.35,49.95 60.35,46.95 66.75,48.4 68.25,48.4 70.5,48.4 73,48.4 76,48.4 78.25,48.4 81.25,48.4 79.75,46.9 64.75,48.4 59.5,51.15 61.25,48.4 59.5,48.4
  pour Top (no thermals): 58.5,33.5 88,33.5 88,37.5 100.5,37.5 100.5,60.25 58.25,60.25 58.25,33.5
  pour Bottom (no thermals): 58.25,60.25 100.5,60.25 100.5,37.5 88,37.5 88,33.5 58.25,33.5
N$1
  Top 1.27: 89.4,35.25 U$24.A
  Top 1.5: U$7.A 89.4,35.25
N$2
  Top 1.27: 84.26,31.06 U$7.C
  Top 2: R10.2 84.26,31.06
  Bottom 1.27: 81.57,30.55 R10.2
  Bottom 2: U$2.GATE 81.57,30.55
N$4
  Bottom 1.27: U$20.A 66.68,15.56 U$21.A
N$6
  Top 0.406: L1.2 5.51,46.26 U$9.PIN1
  Bottom 0.406: U$9.PIN1 9.44,46.26 C20.1 C19.1
N$7  (1 unrouted)
  Top 0.406: U$17.3:CATHODE 92.57,20.44 R1.2
N$9
  Top 0.406: U$8.C 64.5,5.89 LED2.A
N$10
  Top 1.27: R11.2 U$1.GATE
  Bottom 1.27: U$20.C R11.2
N$14
  Top 0.406: U$22.C 4.5,6.49 3.3_CONFIRM.A
N$17
  Top 0.406: U$11.C 57.77,4.22 PWR_CONFIRM.A
TEENSY_FET_DRIVER_SIGNAL  (via drill 0.35)
  Top 0.406: v25.25,3.75 20.75,3.75 15,9.5 11.5,9.5 8.46,12.54 SV1.2 | J1.6 44.23,1.5 83.25,1.5 92.44,10.69 U$17.1.ANODE
  Bottom 0.406: J1.6 36.32,3.75 v25.25,3.75

### Text on the board
tPlace: M- | M+ | GND / ISO | 3.3V / ISO | TENSY / DRV / SIG | PWR / CONFIRM | 12V / CONFIRM | 12V / PWR | 12V / EN | FET / DVR / SIG
bPlace: DC Motor Controller / / MAX 30V, 40A